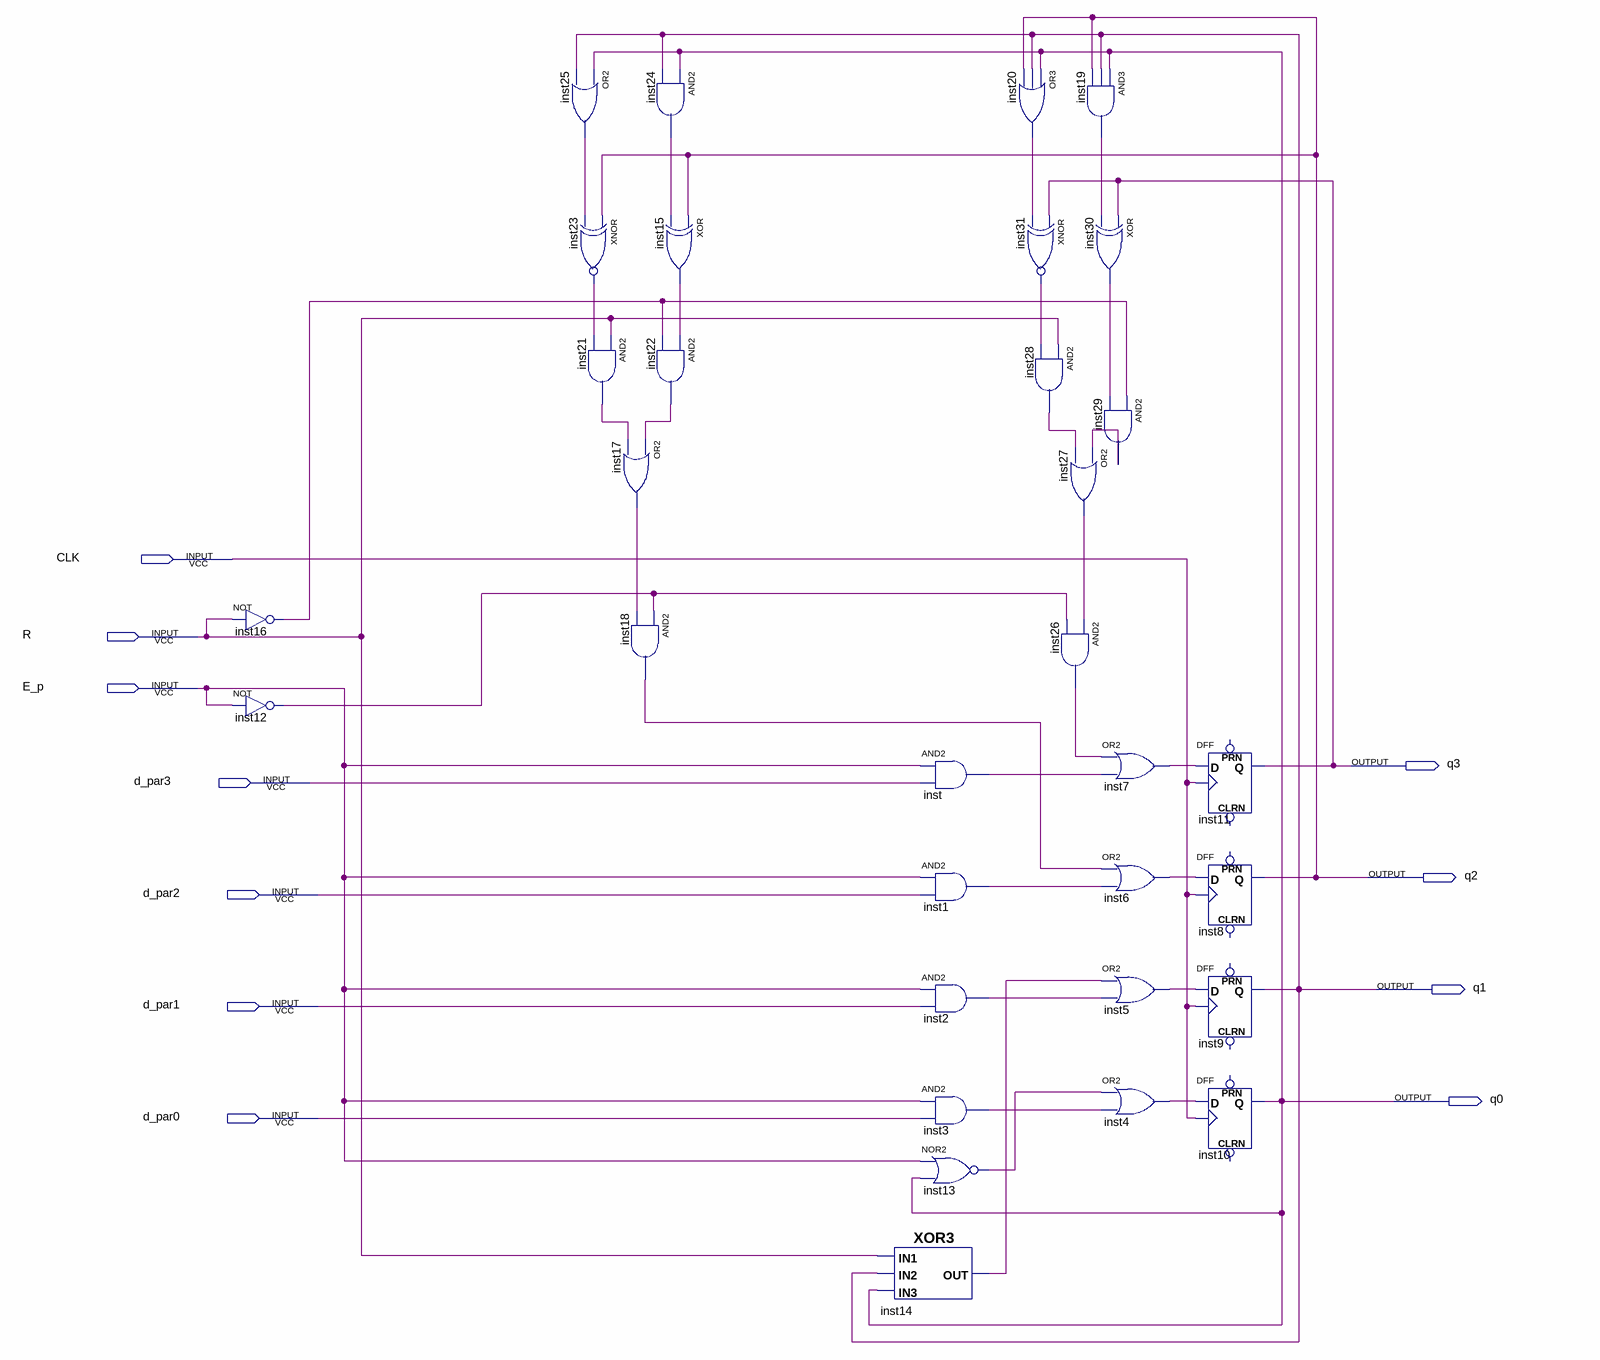
[diagram p0: schematic sheet]
// Quartus schematic Problema51.bdf as structural Verilog: 32 symbols, 11 pins
module Problema51 (
  input  CLK,
  input  R,
  input  E_p,
  input  d_par3,
  input  d_par2,
  input  d_par1,
  input  d_par0,
  output q3,
  output q2,
  output q1,
  output q0
);

  wire inst1_out, inst2_out, inst3_out, inst4_out, inst5_out, inst6_out, inst7_out, inst12_out, inst13_out,
       inst14_out, inst15_out, inst16_out, inst17_out, inst18_out, inst19_out, inst20_out, inst21_out,
       inst22_out, inst23_out, inst24_out, inst25_out, inst26_out, inst27_out, inst28_out, inst29_out,
       inst30_out, inst31_out, inst_out;

  not inst16 (inst16_out, R);
  not inst12 (inst12_out, E_p);
  or inst25 (inst25_out, q0, q1);
  xnor inst23 (inst23_out, q2, inst25_out);
  and inst21 (inst21_out, R, inst23_out);
  and inst24 (inst24_out, q0, q1);
  xor inst15 (inst15_out, q2, inst24_out);
  and inst22 (inst22_out, inst15_out, inst16_out);
  or inst17 (inst17_out, inst22_out, inst21_out);
  and inst18 (inst18_out, inst12_out, inst17_out);
  and inst (inst_out, E_p, d_par3);
  and inst1 (inst1_out, E_p, d_par2);
  and inst2 (inst2_out, E_p, d_par1);
  and inst3 (inst3_out, E_p, d_par0);
  nor inst13 (inst13_out, E_p, q0);
  XOR3 inst14 (.IN3(q0), .IN1(R), .IN2(q1), .OUT(inst14_out));
  or inst20 (inst20_out, q0, q1, q2);
  and inst19 (inst19_out, q0, q1, q2);
  xnor inst31 (inst31_out, q3, inst20_out);
  and inst28 (inst28_out, R, inst31_out);
  or inst27 (inst27_out, inst29_out, inst28_out);
  and inst26 (inst26_out, inst27_out, inst12_out);
  xor inst30 (inst30_out, q3, inst19_out);
  and inst29 (inst29_out, inst16_out, inst30_out);
  or inst7 (inst7_out, inst26_out, inst_out);
  or inst6 (inst6_out, inst18_out, inst1_out);
  or inst5 (inst5_out, inst14_out, inst2_out);
  or inst4 (inst4_out, inst13_out, inst3_out);
  DFF inst11 (.CLK(CLK), .D(inst7_out), .Q(q3));  // open: CLRN, PRN
  DFF inst8 (.CLK(CLK), .D(inst6_out), .Q(q2));  // open: CLRN, PRN
  DFF inst9 (.CLK(CLK), .D(inst5_out), .Q(q1));  // open: CLRN, PRN
  DFF inst10 (.CLK(CLK), .D(inst4_out), .Q(q0));  // open: CLRN, PRN
endmodule
